# EAGLE design 26l6420_adapter (EAGLE 7.6.0)
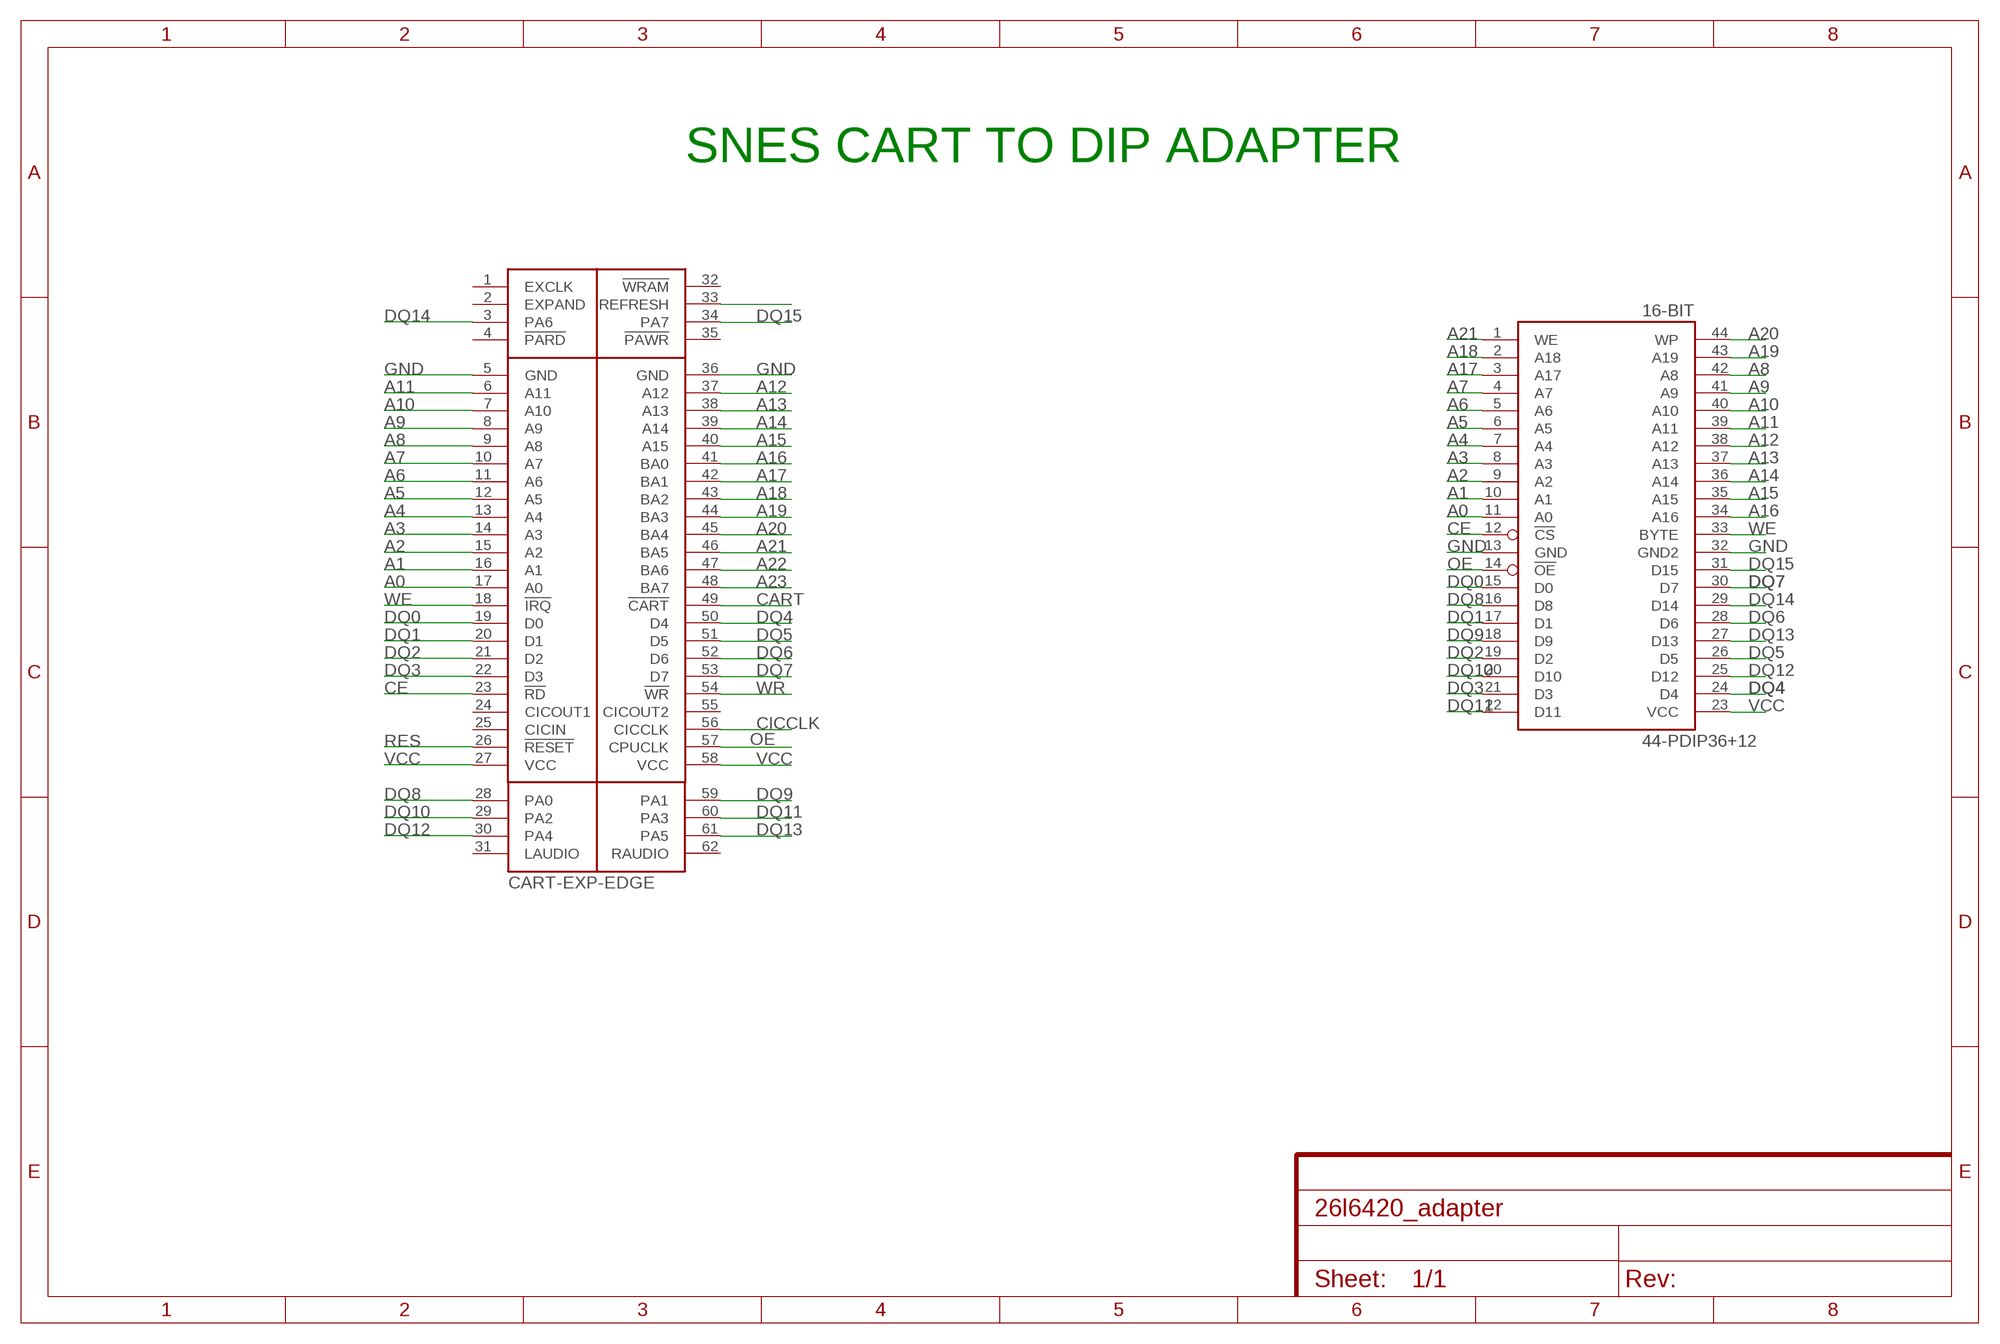
[diagram p0: schematic, sheet 1]

## Parts
16-BIT  44-PDIP36+12  [44-PDIP]
U$1  CART-EXP-EDGE  [CART-EXP-PINS-LONG]

## Nets
A0: 16-BIT.11(A0) U$1.17(A0)
A1: 16-BIT.10(A1) U$1.16(A1)
A2: 16-BIT.9(A2) U$1.15(A2)
A3: 16-BIT.8(A3) U$1.14(A3)
A4: 16-BIT.7(A4) U$1.13(A4)
A5: 16-BIT.6(A5) U$1.12(A5)
A6: 16-BIT.5(A6) U$1.11(A6)
A7: 16-BIT.4(A7) U$1.10(A7)
A8: 16-BIT.42(A8) U$1.9(A8)
A9: 16-BIT.41(A9) U$1.8(A9)
A10: 16-BIT.40(A10) U$1.7(A10)
A11: 16-BIT.39(A11) U$1.6(A11)
A12: 16-BIT.38(A12) U$1.37(A12)
A13: 16-BIT.37(A13) U$1.38(A13)
A14: 16-BIT.36(A14) U$1.39(A14)
A15: 16-BIT.35(A15) U$1.40(A15)
A16: 16-BIT.34(A16) U$1.41(BA0)
A17: 16-BIT.3(A17) U$1.42(BA1)
A18: 16-BIT.2(A18) U$1.43(BA2)
A19: 16-BIT.43(A19) U$1.44(BA3)
A20: 16-BIT.44(WP) U$1.45(BA4)
A21: 16-BIT.1(WE) U$1.46(BA5)
A22: U$1.47(BA6)
A23: U$1.48(BA7)
CART: U$1.49(!CART)
CE: 16-BIT.12(!CS) U$1.23(!RD)
CICCLK: U$1.56(CICCLK)
DQ0: 16-BIT.15(D0) U$1.19(D0)
DQ1: 16-BIT.17(D1) U$1.20(D1)
DQ2: 16-BIT.19(D2) U$1.21(D2)
DQ3: 16-BIT.21(D3) U$1.22(D3)
DQ4: 16-BIT.24(D4) U$1.50(D4)
DQ5: 16-BIT.26(D5) U$1.51(D5)
DQ6: 16-BIT.28(D6) U$1.52(D6)
DQ7: 16-BIT.30(D7) U$1.53(D7)
DQ8: 16-BIT.16(D8) U$1.28(PA0)
DQ9: 16-BIT.18(D9) U$1.59(PA1)
DQ10: 16-BIT.20(D10) U$1.29(PA2)
DQ11: 16-BIT.22(D11) U$1.60(PA3)
DQ12: 16-BIT.25(D12) U$1.30(PA4)
DQ13: 16-BIT.27(D13) U$1.61(PA5)
DQ14: 16-BIT.29(D14) U$1.3(PA6)
DQ15: 16-BIT.31(D15) U$1.34(PA7)
GND [gnd]: 16-BIT.13(GND) 16-BIT.32(GND2) U$1.5(GND) U$1.36(GND)
OE: 16-BIT.14(!OE) U$1.57(CPUCLK)
REFRESH: U$1.33(REFRESH)
RES: U$1.26(!RESET)
VCC [power]: 16-BIT.23(VCC) U$1.27(VCC) U$1.58(VCC)
WE: 16-BIT.33(BYTE) U$1.18(!IRQ)
WR: U$1.54(!WR)
Unconnected: U$1.1(EXCLK) U$1.2(EXPAND) U$1.4(!PARD) U$1.24(CICOUT1) U$1.25(CICIN) U$1.31(LAUDIO) U$1.32(!WRAM) U$1.35(!PAWR) U$1.55(CICOUT2) U$1.62(RAUDIO)

## Notes on the sheet
- SNES CART TO DIP ADAPTER

## Library data of the parts
16-BIT = snes_cart_mod3:44-PDIP: 48-pin SNES MaskROM
U$1 = snes_cart_mod4:CART-EXP: 62-pin SNES cart edge with expansion connectors

## Net classes
0 default: width 0.203 mm, drill 0.406 mm, clearance 0.203 mm
1 power: width 0.61 mm, drill 0.406 mm, clearance 0.203 mm
2 gnd: width 0.406 mm, drill 0.406 mm, clearance 0.203 mm
3 power usb: width 0.508 mm, drill 0.406 mm, clearance 0.203 mm

## Board
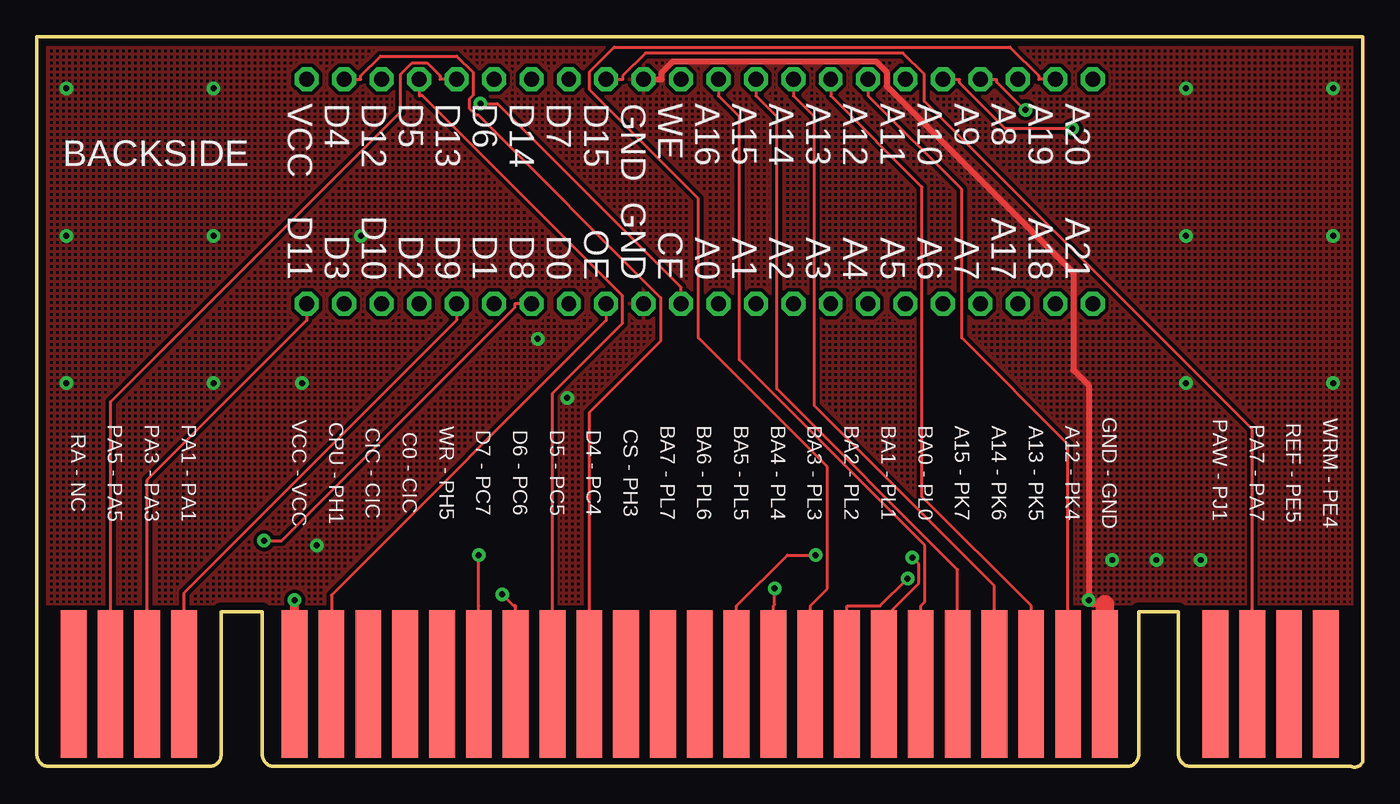
[diagram p1: board, top side]
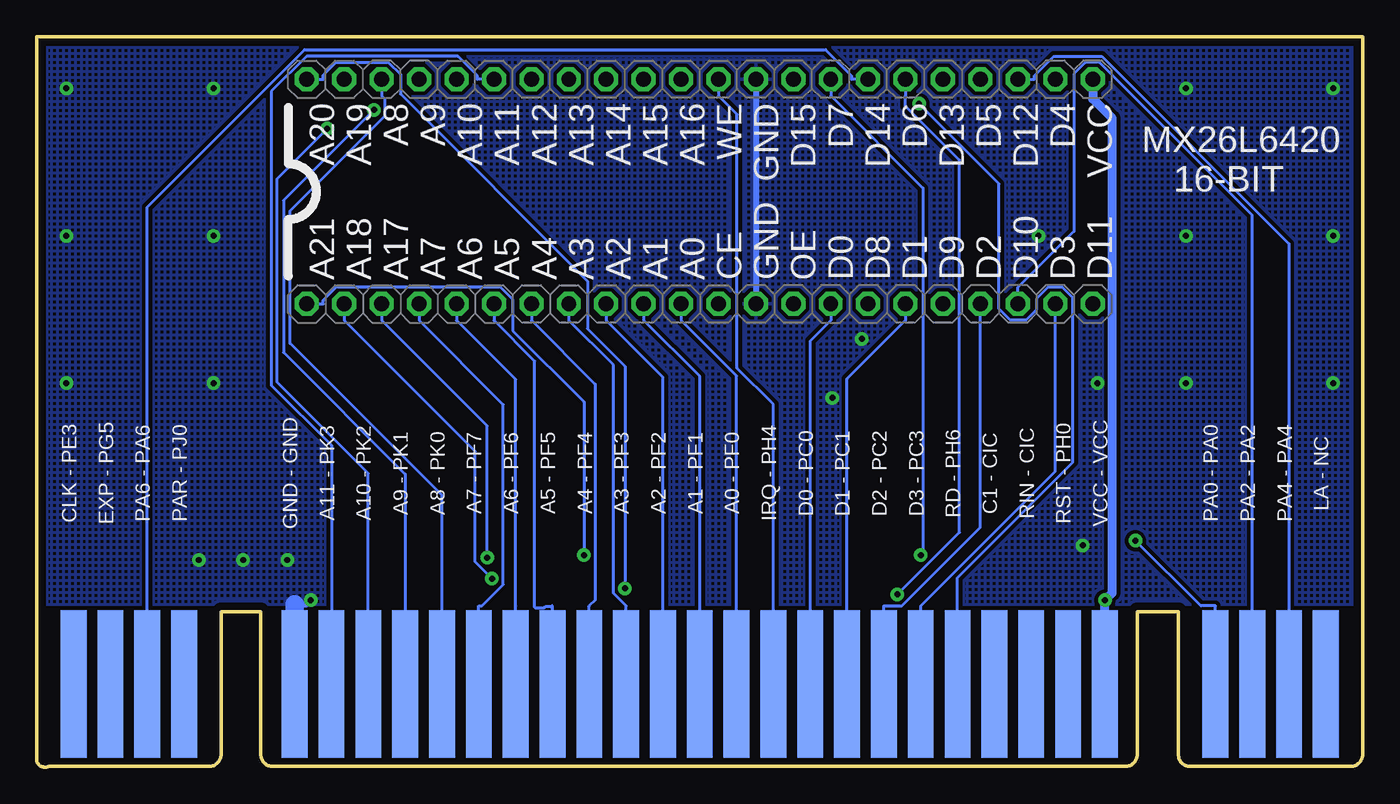
[diagram p2: board, bottom side, seen from below]

Size 90 x 49.55 mm. Coordinates in mm from the lower left corner, seen from the top.
Outline: 0,3.75 0,13.55 0,49.55 90,49.55 90,13.55 90,0.35 arc-90 89.2,0.05 78.9,0.05 78.3,0.05 arc-90 77.5,0.85 77.5,10.55 74.8,10.55 74.8,0.85 arc-90 74,0.05 16.1,0.05 arc-90 15.3,0.85 15.3,10.55 12.5,10.55 12.5,0.85 arc-90 11.8,0.05 0.8,0.05 arc-90 0,0.85
Outline: 0,3.75 0,0.85
Outline: 0,0.85 0,3.75
Outline: 0,3.75 0,0.85
Copper layers (1*16): Top 0.035mm / dielectric 1.5mm / Bottom 0.035mm
Design rules "SparkFun_mod": minimum track width 8mil, minimum drill 16mil, track to track 8mil, track to pad 8mil, pad to pad 8mil, via to via 8mil, smd to smd 8mil, copper to edge 20mil, drill to drill 12mil, minimum pad ring 12mil, minimum via ring 10mil, stop-mask expansion 4mil, vias tented up to drill 25mil, thermal gap 10mil

### Footprints (pad centres in the part's own frame; a part is rotated, then mirrored left to right if it is on the bottom)
44-PDIP = drill 1.016 octagon: 1 26.67,7.62; 2 24.13,7.62; 3 21.59,7.62; 4 19.05,7.62; 5 16.51,7.62; 6 13.97,7.62; 7 11.43,7.62; 8 8.89,7.62; 9 6.35,7.62; 10 3.81,7.62; 11 1.27,7.62; 12 -1.27,7.62; 13 -3.81,7.62; 14 -6.35,7.62; 15 -8.89,7.62; 16 -11.43,7.62; 17 -13.97,7.62; 18 -16.51,7.62; 19 -19.05,7.62; 20 -21.59,7.62; 21 -24.13,7.62; 22 -26.67,7.62; 23 -26.67,-7.62; 24 -24.13,-7.62; 25 -21.59,-7.62; 26 -19.05,-7.62; 27 -16.51,-7.62; 28 -13.97,-7.62; 29 -11.43,-7.62; 30 -8.89,-7.62; 31 -6.35,-7.62; 32 -3.81,-7.62; 33 -1.27,-7.62; 34 1.27,-7.62; 35 3.81,-7.62; 36 6.35,-7.62; 37 8.89,-7.62; 38 11.43,-7.62; 39 13.97,-7.62; 40 16.51,-7.62; 41 19.05,-7.62; 42 21.59,-7.62; 43 24.13,-7.62; 44 26.67,-7.62
CART-EXP-PINS-LONG = smd 1.75 x 10 bottom: 1 42.5,-1.42; 2 40,-1.42; 3 37.5,-1.42; 4 35,-1.42; 5 27.5,-1.42; 6 25,-1.42; 7 22.5,-1.42; 8 20,-1.42; 9 17.5,-1.42; 10 15,-1.42; 11 12.5,-1.42; 12 10,-1.42; 13 7.5,-1.42; 14 5,-1.42; 15 2.5,-1.42; 16 0,-1.42; 17 -2.5,-1.42; 18 -5,-1.42; 19 -7.5,-1.42; 20 -10,-1.42; 21 -12.5,-1.42; 22 -15,-1.42; 23 -17.5,-1.42; 24 -20,-1.42; 25 -22.5,-1.42; 26 -25,-1.42; 27 -27.5,-1.42; 28 -35,-1.42; 29 -37.5,-1.42; 30 -40,-1.42; 31 -42.5,-1.42 | smd 1.75 x 10: 32 42.5,-1.42; 33 40,-1.42; 34 37.5,-1.42; 35 35,-1.42; 36 27.5,-1.42; 37 25,-1.42; 38 22.5,-1.42; 39 20,-1.42; 40 17.5,-1.42; 41 15,-1.42; 42 12.5,-1.42; 43 10,-1.42; 44 7.5,-1.42; 45 5,-1.42; 46 2.5,-1.42; 47 0,-1.42; 48 -2.5,-1.42; 49 -5,-1.42; 50 -7.5,-1.42; 51 -10,-1.42; 52 -12.5,-1.42; 53 -15,-1.42; 54 -17.5,-1.42; 55 -20,-1.42; 56 -22.5,-1.42; 57 -25,-1.42; 58 -27.5,-1.42; 59 -35,-1.42; 60 -37.5,-1.42; 61 -40,-1.42; 62 -42.5,-1.42

### Placement (x,y rotation side)
16-BIT  45,39.05 180 bottom
U$1  45,7.05 0 top

### Tracks (layer width: path | path; a pad name or v marks a point on that pad's centre or on a via)
A0
  Bottom 0.203: U$1.17 42.5,26.55 46.27,30.32 16-BIT.11
A1
  Bottom 0.203: U$1.16 45,26.51 48.81,30.32 16-BIT.10
A2
  Bottom 0.203: U$1.15 47.5,26.47 51.35,30.32 16-BIT.9
A3
  Bottom 0.203: U$1.14 50,10.94 50.87,11.81 50.87,27.29 53.89,30.32 16-BIT.8
A4
  Bottom 0.203: U$1.13 52.5,10.94 52.1,11.34 52.1,25.99 56.43,30.32 16-BIT.7
A5
  Bottom 0.203: U$1.12 55,10.94 55.04,10.94 55.11,10.87 55.49,10.87 55.58,10.79 56.15,10.79 56.21,10.85 56.21,27.55 58.97,30.32 16-BIT.6
A6
  Bottom 0.203: 16-BIT.5 61.51,30.32 57.5,26.31 57.5,10.94 U$1.11
A7
  Bottom 0.203: 16-BIT.4 64.05,30.32 58.34,24.6 58.34,12.39 59.79,10.94 60,10.94 U$1.10
A8
  Bottom 0.203: U$1.9 62.5,10.94 62.5,18.45 72.81,28.76 72.81,37.75 66.36,44.2 66.36,45.32 66.59,45.56 16-BIT.42
A9  (via drill 0.41 pad 0.91)
  Top 0.203: 16-BIT.41 65.17,46.67 65.17,46.47 67.03,44.6 v67.12,44.6
  Bottom 0.203: v67.12,44.6 73.26,38.46 73.26,28.14 65,19.88 U$1.8
A10  (via drill 0.41 pad 0.91)
  Top 0.203: 16-BIT.40 62.63,46.67 62.63,46.44 65.74,43.33 v70.28,43.33
  Bottom 0.203: U$1.7 67.5,19.93 73.67,26.11 73.67,39.93 v70.28,43.33
A11
  Bottom 0.203: U$1.6 70,21.82 74.08,25.91 74.08,45.85 71.69,48.23 61.42,48.23 60.09,46.91 60.09,46.67 16-BIT.39
A12
  Top 0.203: 16-BIT.38 56.43,45.56 62.78,39.21 62.78,29.12 70,21.9 U$1.37
A13
  Top 0.203: U$1.38 67.5,10.94 60.09,18.35 60.09,39.36 53.89,45.56 16-BIT.37
A14
  Top 0.203: 16-BIT.36 51.35,45.56 52.77,44.13 52.77,24.53 65,12.3 65,10.94 U$1.39
A15
  Top 0.203: 16-BIT.35 48.81,45.56 50.23,44.13 50.23,25.66 62.5,13.4 U$1.40
A16
  Top 0.203: 16-BIT.34 46.27,45.56 47.69,44.13 47.69,27.63 60.27,15.05 60.27,11.21 60,10.94 U$1.41
A17  (via drill 0.41 pad 0.91)
  Top 0.203: U$1.42 57.5,10.11 59.86,12.48 59.86,13.78 v59.43,14.22
  Bottom 0.203: v59.43,14.22 59.43,23.15 66.59,30.32 16-BIT.3
A18  (via drill 0.41 pad 0.91)
  Top 0.203: U$1.43 55,10.94 57.25,10.94 v59.1,12.79
  Bottom 0.203: v59.1,12.79 60.24,13.93 60.24,21.43 69.13,30.32 16-BIT.2
A19
  Top 0.203: 16-BIT.43 68.01,46.67 68.01,46.91 66.06,48.86 39.19,48.86 37.53,47.2 37.53,45.97 44.91,38.58 44.91,29.13 53.66,20.37 53.66,12.1 52.5,10.94 U$1.44
A20  (via drill 0.41 pad 0.91)
  Top 0.203: U$1.45 50,10.94 50.08,11.02 v50.08,12.14
  Bottom 0.203: 16-BIT.44 70.55,46.67 70.55,46.95 69.68,47.83 66.15,47.83 65.32,47 65.32,45.68 52.62,32.98 52.62,29.75 50.08,27.22 v50.08,12.14
A21  (via drill 0.41 pad 0.91)
  Top 0.203: U$1.46 47.5,10.94 50.94,14.38 v52.86,14.38
  Bottom 0.203: v52.86,14.38 52.86,24.78 57.7,29.62 57.7,31.74 58.54,32.58 69.63,32.58 70.55,31.67 70.55,31.43 16-BIT.1
CE  (via drill 0.41 pad 0.91)
  Top 0.203: 16-BIT.12 43.73,32.55 31.26,45.02 v30.12,45.02
  Bottom 0.203: U$1.23 27.5,12.86 19.68,20.68 19.68,31.86 20.38,32.55 21.37,32.55 22.14,31.78 22.14,31.05 22.87,30.32 23.91,30.32 24.68,31.09 24.68,39.58 v30.12,45.02
DQ0
  Bottom 0.203: 16-BIT.15 36.11,30.32 37.5,28.93 U$1.19
DQ1
  Bottom 0.203: 16-BIT.17 31.03,30.32 35,26.35 U$1.20
DQ2
  Bottom 0.203: U$1.21 32.5,10.94 31.29,10.94 25.95,16.27 16-BIT.19
DQ3
  Bottom 0.203: 16-BIT.21 20.87,20.07 30,10.94 U$1.22
DQ4
  Top 0.203: U$1.50 37.5,24.05 42.35,28.9 42.35,31.86 29.96,44.26 29.8,44.26 29.36,44.7 29.36,45.34 29.62,45.6 29.62,47.14 28.5,48.25 23.33,48.25 21.99,46.91 21.99,46.67 16-BIT.24
DQ5
  Top 0.203: 16-BIT.26 25.95,45.56 26.18,45.56 39.77,31.97 39.77,30.12 35,25.36 U$1.51
DQ6  (via drill 0.41 pad 0.91)
  Top 0.203: U$1.52 32.5,10.94 32.37,10.94 v31.59,11.72
  Bottom 0.203: v31.59,11.72 27.37,15.93 27.37,41.2 31.03,44.85 31.03,45.56 16-BIT.28
DQ7  (via drill 0.41 pad 0.91)
  Top 0.203: v30,14.39 30,10.94 U$1.53
  Bottom 0.203: v30,14.39 29.84,14.55 29.84,39.29 36.11,45.56 16-BIT.30
DQ8  (via drill 0.41 pad 0.91)
  Top 0.203: 16-BIT.16 32.45,31.43 32.45,31.2 16.62,15.37 v15.42,15.37
  Bottom 0.203: U$1.28 10,10.94 10.98,10.94 v15.42,15.37
DQ9
  Top 0.203: 16-BIT.18 28.49,30.32 10,11.83 10,10.94 U$1.59
DQ10
  Bottom 0.203: 16-BIT.20 23.41,32.55 19.6,36.36 19.6,47.05 18.82,47.83 17.88,47.83 7.5,37.45 U$1.29
DQ11
  Top 0.203: U$1.60 7.5,19.49 18.33,30.32 16-BIT.22
DQ12
  Bottom 0.203: U$1.30 5,35.53 17.71,48.23 20.96,48.23 22.29,46.91 22.29,46.67 16-BIT.25
DQ13
  Top 0.203: 16-BIT.27 27.37,46.67 27.37,46.91 26.48,47.79 25.46,47.79 24.68,47.01 24.68,44.48 5,24.8 U$1.61
DQ14
  Bottom 0.203: 16-BIT.29 34.69,46.67 34.69,46.91 36.46,48.68 71.82,48.68 82.5,38 U$1.3
DQ15
  Top 0.203: 16-BIT.31 39.77,46.67 39.77,46.91 41.32,48.46 58.8,48.46 60.24,47.02 60.24,45.18 82.5,22.92 U$1.34
GND  (via drill 0.41 pad 0.91)
  Top 0.406: 16-BIT.32 42.41,46.67 42.41,47.13 43.17,47.9 56.94,47.9 57.7,47.14 57.7,46.22 70.36,33.56 70.36,26.95 71.41,25.9 v71.41,11.33 71.69,11.04 72.5,11.04
  Top 1.27: U$1.36 72.5,11.04
  Bottom 0.406: 72.5,11.04 71.69,11.04 v71.41,11.33 | 16-BIT.32 16-BIT.13
  Bottom 1.27: U$1.36 72.5,11.04
  other vias: 78,46.05 88,46.05 78,36.05 88,36.05 78,26.05 88,26.05 12,46.05 2,46.05 2,36.05 2,26.05 12,36.05 12,26.05 22,36.05 18,26.05 19,15.05 34,29.05 36,25.05 73,14.05 76,14.05 79,14.05
  pour Top (isolate 0.254, hatched): 0,49.55 90,49.55 90,11.05 0,11.05
  pour Bottom (isolate 0.254, hatched): 0,49.55 90,49.55 90,11.05 0,11.05
OE
  Top 0.203: U$1.57 20,11.67 38.65,30.32 16-BIT.14
VCC  (via drill 0.41 pad 0.91)
  Top 0.61: v17.5,11.33 17.5,11.14 U$1.58
  Bottom 0.61: 16-BIT.23 18.33,45.35 17,44.03 17,11.83 v17.5,11.33 U$1.58
WE
  Bottom 0.203: 16-BIT.33 43.73,45.56 42.46,44.29 42.46,27.08 40,24.62 U$1.18

### Text on the board
tNames: A20 / A19 / A8 / A9 / A10 / A11 / A12 / A13 / A14 / A15 / A16 / WE / GND / D15 / D7 / D14 / D6 / D13 / D5 / D12 / D4 / VCC | BACKSIDE | A21 / A18 / A17 / A7 / A6 / A5 / A4 / A3 / A2 / A1 / A0 / CE / GND / OE / D0 / D8 / D1 / D9 / D2 / D10 / D3 / D11 | WRM - PE4 / REF - PE5 / PA7 - PA7 / PAW - PJ1 / / / GND - GND / A12 - PK4 / A13 - PK5 / A14 - PK6 / A15 - PK7 / BA0 - PL0 / BA1 - PL1 / BA2 - PL2 / BA3 - PL3 / BA4 - PL4 / BA5 - PL5 / BA6 - PL6 / BA7 - PL7 / CS - PH3 / D4 - PC4 / D5 - PC5 / D6 - PC6 / D7 - PC7 / WR - PH5 / C0 - CIC / CIC - CIC / CPU - PH1 / VCC - VCC / / / PA1 - PA1 / PA3 - PA3 / PA5 - PA5 / RA - NC
bNames: A20 / A19 / A8 / A9 / A10 / A11 / A12 / A13 / A14 / A15 / A16 / WE / GND / D15 / D7 / D14 / D6 / D13 / D5 / D12 / D4 / VCC | MX26L6420 / 16-BIT | A21 / A18 / A17 / A7 / A6 / A5 / A4 / A3 / A2 / A1 / A0 / CE / GND / OE / D0 / D8 / D1 / D9 / D2 / D10 / D3 / D11 | CLK - PE3 / EXP - PG5 / PA6 - PA6 / PAR - PJ0 / / / GND - GND / A11 - PK3 / A10 - PK2 / A9 - PK1 / A8 - PK0 / A7 - PF7 / A6 - PF6 / A5 - PF5 / A4 - PF4 / A3 - PF3 / A2 - PF2 / A1 - PF1 / A0 - PF0 / IRQ - PH4 / D0 - PC0 / D1 - PC1 / D2 - PC2 / D3 - PC3 / RD - PH6 / C1 - CIC / RIN - CIC / RST - PH0 / VCC - VCC / / / PA0 - PA0 / PA2 - PA2 / PA4 - PA4 / LA - NC